# EAGLE schematic Transmitter Rev 1 (EAGLE 9.4.2)
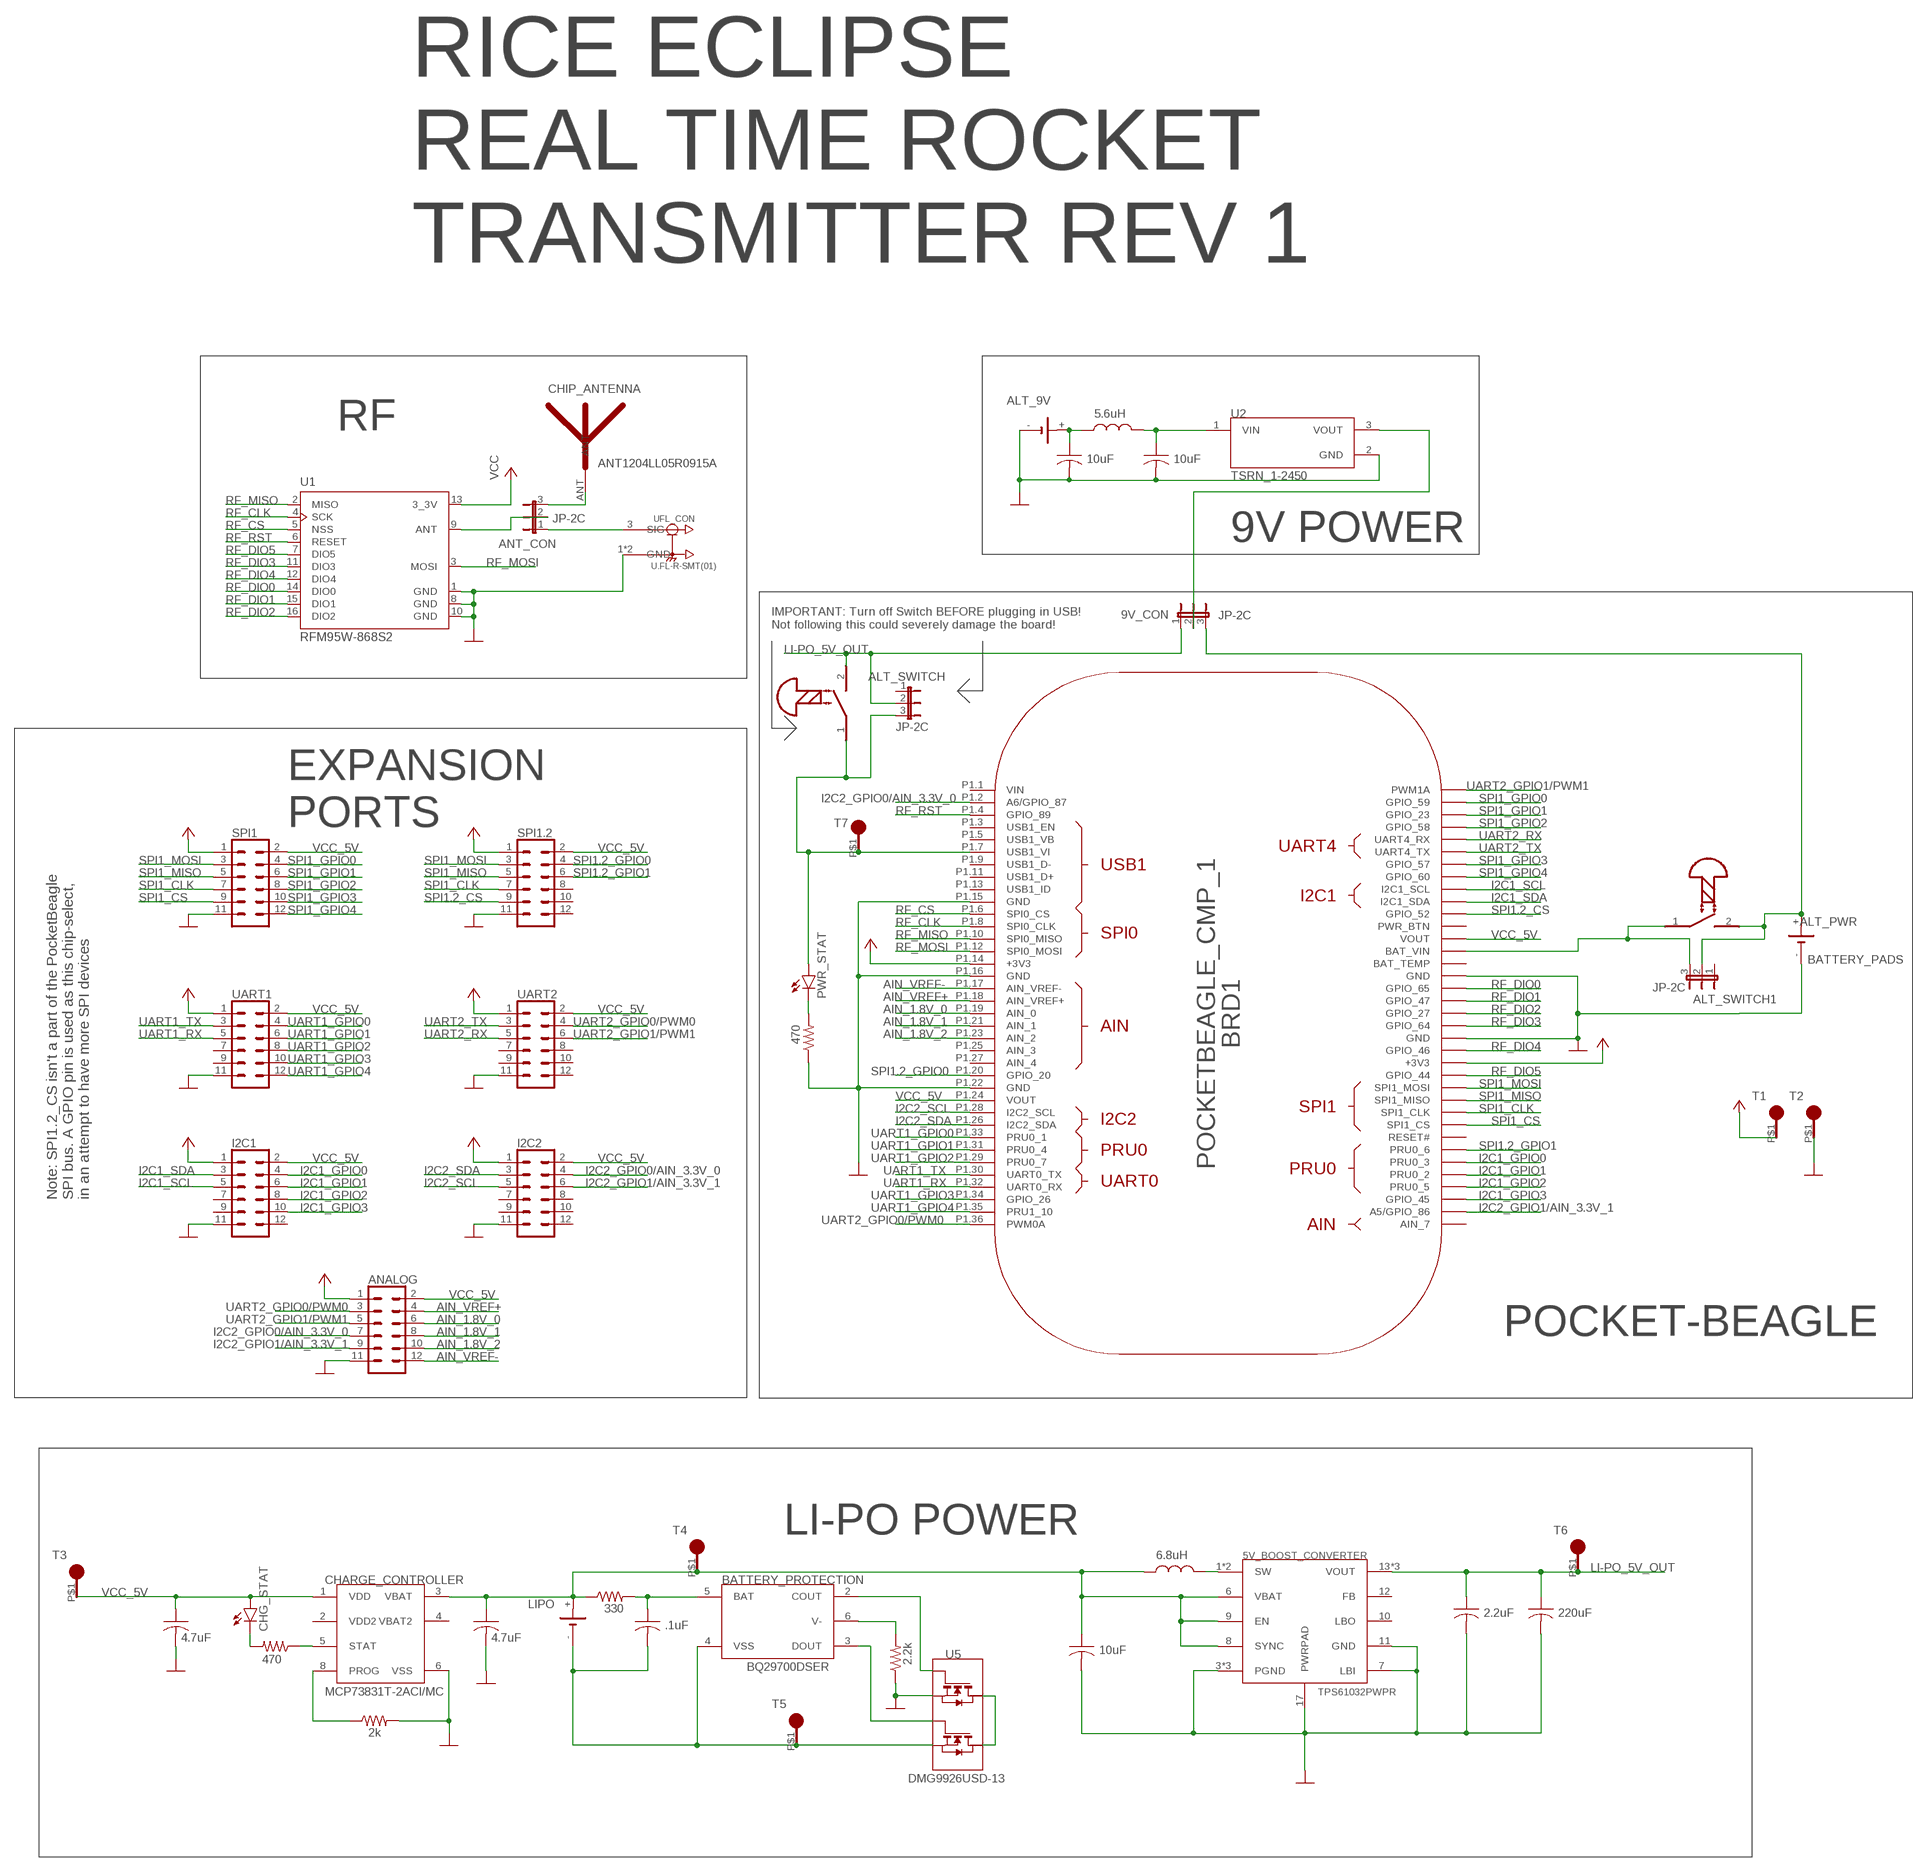
[diagram p0: schematic, sheet 1]

## Parts
5V_BOOST_CONVERTER  TPS61032PWPR  [SOP65P640X110-17N]
9V_C1  10uF  C-SMD  [C1206]
9V_C2  10uF  C-SMD  [C1206]
9V_CON  JP-2C  [JP2]
ALT_9V  BATTERY_PADS  [POWER_PADS]
ALT_PWR  BATTERY_PADS  [POWER_PADS]
ALT_SWITCH  JP-2C  [JP2]
ALT_SWITCH1  JP-2C  [JP2]
ANALOG  2X6 FEMALE  SENSOR_BREAKOUTPTH_FEMALE  [2X6]
ANT_CON  JP-2C  [JP2]
BATTERY_PROTECTION  BQ29700DSER  [SON50P150X150X80-6N]
BRD1  POCKETBEAGLE_CMP_1  [POCKETBEAGLE_CMP]
CHARGE_CONTROLLER  MCP73831T-2ACI/MC  [SON50P200X300X100-9N]
CHG_C1  4.7uF  C-SMD  [C1206]
CHG_C2  4.7uF  C-SMD  [C1206]
CHG_C3  .1uF  C-SMD  [C1206]
CHG_C4  10uF  C-SMD  [C1206]
CHG_C5  2.2uF  C-SMD  [C1206]
CHG_C6  220uF  C-SMD  [C1206]
CHG_R1  2k  R-SMD  [RES_SMW52R0JT]
CHG_R2  470  R-SMD  [RES_SMW52R0JT]
CHG_R3  330  R-SMD  [RES_SMW52R0JT]
CHG_R4  2.2k  R-SMD  [RES_SMW52R0JT]
CHG_R5  470  R-SMD  [RES_SMW52R0JT]
CHG_STAT  LED5MM  [LED5MM]
CHIP_ANTENNA  ANT1204LL05R0915A  [SMD_ANTENNA]
I2C1  2X6 FEMALE  SENSOR_BREAKOUTPTH_FEMALE  [2X6]
I2C2  2X6 FEMALE  SENSOR_BREAKOUTPTH_FEMALE  [2X6]
L1  5.6uH  L_SMD  [L-DS75LC]
L2  6.8uH  L_SMD  [L-DS75LC]
LIPO  BATTERY_PADS  [POWER_PADS]
PWR_STAT  LED5MM  [LED5MM]
SPI1  SNSR_BRKOUT  SENSOR_BREAKOUTPTH_FEMALE  [2X6]
SPI1.2  2X6 FEMALE  SENSOR_BREAKOUTPTH_FEMALE  [2X6]
SW1  SCREW_SWITCH  [SCREW_SWITCH]
SW2  SCREW_SWITCH  [SCREW_SWITCH]
T1  TEST_PAD  [TEST_PAD]
T2  TEST_PAD  [TEST_PAD]
T3  TEST_PAD  [TEST_PAD]
T4  TEST_PAD  [TEST_PAD]
T5  TEST_PAD  [TEST_PAD]
T6  TEST_PAD  [TEST_PAD]
T7  TEST_PAD  [TEST_PAD]
U1  RFM95W-868S2  [XCVR_RFM95W-868S2]
U2  TSRN_1-2450  [CONV_TSRN_1-2433]
U5  DMG9926USD-13  [SOIC127P600X175-8N]
UART1  2X6 FEMALE  SENSOR_BREAKOUTPTH_FEMALE  [2X6]
UART2  2X6 FEMALE  SENSOR_BREAKOUTPTH_FEMALE  [2X6]
UFL_CON  U.FL-R-SMT(01)  [HRS_U.FL-R-SMT(01)]

## Nets
AIN_1.8V_0: ANALOG.6 BRD1.P1.19(AIN_0)
AIN_1.8V_1: ANALOG.8 BRD1.P1.21(AIN_1)
AIN_1.8V_2: ANALOG.10 BRD1.P1.23(AIN_2)
AIN_VREF+: ANALOG.4 BRD1.P1.18(AIN_VREF+)
AIN_VREF-: ANALOG.12 BRD1.P1.17(AIN_VREF-)
GND: 5V_BOOST_CONVERTER.3(PGND) 5V_BOOST_CONVERTER.4(PGND) 5V_BOOST_CONVERTER.5(PGND) 5V_BOOST_CONVERTER.7(LBI) 5V_BOOST_CONVERTER.11(GND) 5V_BOOST_CONVERTER.17(PWRPAD) 9V_C1.2 9V_C2.2 ALT_9V.- ALT_PWR.- ANALOG.11 BRD1.P1.15(GND) BRD1.P1.16(GND) BRD1.P1.22(GND) BRD1.P2.15(GND) BRD1.P2.21(GND) CHARGE_CONTROLLER.6(VSS) CHG_C1.2 CHG_C2.2 CHG_C4.2 CHG_C5.2 CHG_C6.2 CHG_R1.2 CHG_R4.1 CHG_R5.1 I2C1.11 I2C2.11 SPI1.2.11 SPI1.11 T2.P$1 U1.1(GND) U1.8(GND) U1.10(GND) U2.2(GND) U5.1(S1) UART1.11 UART2.11 UFL_CON.1(GND) UFL_CON.2(GND)
I2C1_GPIO0: BRD1.P2.30(PRU0_3) I2C1.4
I2C1_GPIO1: BRD1.P2.32(PRU0_2) I2C1.6
I2C1_GPIO2: BRD1.P2.34(PRU0_5) I2C1.8
I2C1_GPIO3: BRD1.P2.33(GPIO_45) I2C1.10
I2C1_SCL: BRD1.P2.9(I2C1_SCL) I2C1.5
I2C1_SDA: BRD1.P2.11(I2C1_SDA) I2C1.3
I2C2_GPIO0/AIN_3.3V_0: ANALOG.7 BRD1.P1.2(A6/GPIO_87) I2C2.4
I2C2_GPIO1/AIN_3.3V_1: ANALOG.9 BRD1.P2.35(A5/GPIO_86) I2C2.6
I2C2_SCL: BRD1.P1.28(I2C2_SCL) I2C2.5
I2C2_SDA: BRD1.P1.26(I2C2_SDA) I2C2.3
LI-PO_5V_OUT: 5V_BOOST_CONVERTER.13(VOUT) 5V_BOOST_CONVERTER.14(VOUT) 5V_BOOST_CONVERTER.15(VOUT) 9V_CON.1 ALT_SWITCH.2 CHG_C5.1 CHG_C6.1 SW1.2 T6.P$1
N$1: ANT_CON.2 U1.9(ANT)
N$2: ANT_CON.3 CHIP_ANTENNA.ANT
N$3: ANT_CON.1 UFL_CON.3(SIG)
N$4: 9V_CON.3 ALT_PWR.+ ALT_SWITCH1.2 SW2.2
N$5: 9V_CON.2 U2.3(VOUT)
N$6: 9V_C2.1 L1.P$2 U2.1(VIN)
N$7: 9V_C1.1 ALT_9V.+ L1.P$1
N$8: CHG_R5.2 PWR_STAT.K(C)
N$9: CHARGE_CONTROLLER.5(STAT) CHG_R2.1
N$10: CHG_R2.2 CHG_STAT.K(C)
N$11: CHARGE_CONTROLLER.8(PROG) CHG_R1.1
N$12: BATTERY_PROTECTION.5(BAT) CHG_C3.1 CHG_R3.2
N$13: 5V_BOOST_CONVERTER.6(VBAT) 5V_BOOST_CONVERTER.8(SYNC) 5V_BOOST_CONVERTER.9(EN) CHARGE_CONTROLLER.3(VBAT) CHG_C2.1 CHG_C4.1 CHG_R3.1 L2.P$1 LIPO.+ T4.P$1
N$14: BATTERY_PROTECTION.4(VSS) CHG_C3.2 LIPO.- T5.P$1 U5.3(S2)
N$15: U5.5(D2) U5.6(D2) U5.7(D1) U5.8(D1)
N$16: BATTERY_PROTECTION.3(DOUT) U5.4(G2)
N$17: BATTERY_PROTECTION.6(V-) CHG_R4.2
N$18: BATTERY_PROTECTION.2(COUT) U5.2(G1)
N$19: ALT_SWITCH.3 BRD1.P1.7(USB1_VI) PWR_STAT.A SW1.1 T7.P$1
N$20: 5V_BOOST_CONVERTER.1(SW) 5V_BOOST_CONVERTER.2(SW) L2.P$2
N$22: ALT_SWITCH1.3 BRD1.P2.14(BAT_VIN) SW2.1
RF_CLK: BRD1.P1.8(SPI0_CLK) U1.4(SCK)
RF_CS: BRD1.P1.6(SPI0_CS) U1.5(NSS)
RF_DIO0: BRD1.P2.17(GPIO_65) U1.14(DIO0)
RF_DIO1: BRD1.P2.18(GPIO_47) U1.15(DIO1)
RF_DIO2: BRD1.P2.19(GPIO_27) U1.16(DIO2)
RF_DIO3: BRD1.P2.20(GPIO_64) U1.11(DIO3)
RF_DIO4: BRD1.P2.22(GPIO_46) U1.12(DIO4)
RF_DIO5: BRD1.P2.24(GPIO_44) U1.7(DIO5)
RF_MISO: BRD1.P1.10(SPI0_MISO) U1.2(MISO)
RF_MOSI: BRD1.P1.12(SPI0_MOSI) U1.3(MOSI)
RF_RST: BRD1.P1.4(GPIO_89) U1.6(RESET)
SPI1.2_CS: BRD1.P2.10(GPIO_52) SPI1.2.9
SPI1.2_GPIO0: BRD1.P1.20(GPIO_20) SPI1.2.4
SPI1.2_GPIO1: BRD1.P2.28(PRU0_6) SPI1.2.6
SPI1_CLK: BRD1.P2.29(SPI1_CLK) SPI1.2.7 SPI1.7
SPI1_CS: BRD1.P2.31(SPI1_CS) SPI1.9
SPI1_GPIO0: BRD1.P2.2(GPIO_59) SPI1.4
SPI1_GPIO1: BRD1.P2.3(GPIO_23) SPI1.6
SPI1_GPIO2: BRD1.P2.4(GPIO_58) SPI1.8
SPI1_GPIO3: BRD1.P2.6(GPIO_57) SPI1.10
SPI1_GPIO4: BRD1.P2.8(GPIO_60) SPI1.12
SPI1_MISO: BRD1.P2.27(SPI1_MISO) SPI1.2.5 SPI1.5
SPI1_MOSI: BRD1.P2.25(SPI1_MOSI) SPI1.2.3 SPI1.3
UART1_GPIO0: BRD1.P1.33(PRU0_1) UART1.4
UART1_GPIO1: BRD1.P1.31(PRU0_4) UART1.6
UART1_GPIO2: BRD1.P1.29(PRU0_7) UART1.8
UART1_GPIO3: BRD1.P1.34(GPIO_26) UART1.10
UART1_GPIO4: BRD1.P1.35(PRU1_10) UART1.12
UART1_RX: BRD1.P1.32(UART0_RX) UART1.5
UART1_TX: BRD1.P1.30(UART0_TX) UART1.3
UART2_GPIO0/PWM0: ANALOG.3 BRD1.P1.36(PWM0A) UART2.4
UART2_GPIO1/PWM1: ANALOG.5 BRD1.P2.1(PWM1A) UART2.6
UART2_RX: BRD1.P2.5(UART4_RX) UART2.5
UART2_TX: BRD1.P2.7(UART4_TX) UART2.3
VCC: ANALOG.1 BRD1.P1.14(+3V3) BRD1.P2.23(+3V3) I2C1.1 I2C2.1 SPI1.1 SPI1.2.1 T1.P$1 U1.13(3_3V) UART1.1 UART2.1
VCC_5V: ANALOG.2 BRD1.P1.24(VOUT) BRD1.P2.13(VOUT) CHARGE_CONTROLLER.1(VDD) CHG_C1.1 CHG_STAT.A I2C1.2 I2C2.2 SPI1.2 SPI1.2.2 T3.P$1 UART1.2 UART2.2
Unconnected: 5V_BOOST_CONVERTER.10(LBO) 5V_BOOST_CONVERTER.12(FB) ALT_SWITCH1.1 ALT_SWITCH.1 BRD1.P1.1(VIN) BRD1.P1.3(USB1_EN) BRD1.P1.5(USB1_VB) BRD1.P1.9(USB1_D-) BRD1.P1.11(USB1_D+) BRD1.P1.13(USB1_ID) BRD1.P1.25(AIN_3) BRD1.P1.27(AIN_4) BRD1.P2.12(PWR_BTN) BRD1.P2.16(BAT_TEMP) BRD1.P2.26(RESET#) BRD1.P2.36(AIN_7) CHARGE_CONTROLLER.2(VDD2) CHARGE_CONTROLLER.4(VBAT2) I2C1.7 I2C1.9 I2C1.12 I2C2.7 I2C2.8 I2C2.9 I2C2.10 I2C2.12 SPI1.2.8 SPI1.2.10 SPI1.2.12 UART1.7 UART1.9 UART2.7 UART2.8 UART2.9 UART2.10 UART2.12

## Notes on the sheet
- RICE ECLIPSE
  REAL TIME ROCKET
  TRANSMITTER REV 1
- RF
- 9V POWER
- IMPORTANT: Turn off Switch BEFORE plugging in USB! 
  Not following this could severely damage the board!
- EXPANSION
  PORTS
- Note: SPI1.2_CS isn't a part of the PocketBeagle 
  SPI bus. A GPIO pin is used as this chip-select, 
  in an attempt to have more SPI devices
- POCKET-BEAGLE
- LI-PO POWER

## Library data of the parts
5V_BOOST_CONVERTER = RTR:TPS61032PWPR: 5V Buck-Boost Converter; 5V_BOOST_CONVERTER: TPS61032PWPR; F: TPS61032PWPR
9V_C1 9V_C2 CHG_C1-CHG_C6 = RTR:C-SMD: SMD capacitor
9V_CON ALT_SWITCH ALT_SWITCH1 ANT_CON = RTR:JP-2C: JUMPER 2 connection jumper
ALT_9V ALT_PWR LIPO = RTR:BATTERY_PADS: Pads to connect any battery (Li-Po, 9V, etc.)
ANALOG I2C1 I2C2 SPI1.2 UART1 UART2 = RTR:SENSOR_BREAKOUT: .1 inch-spaced 12P sensor breakout Used as a generalized connector for attaching new sensors; PROD_ID: CONN-12423
BATTERY_PROTECTION = RTR:BQ29700DSER: Battery Protection IC
BRD1 = RTR:POCKETBEAGLE_?_1: BeagleBoard.org PocketBeagle What is PocketBeagle? PocketBeagle is an ultra-tiny-yet-complete open-source USB-key-fob computer. PocketBeagle features an incredible low cost, slick design and simple usage, making PocketBeagle the ideal development board for beginners and professionals alike. Processor: Octavo Systems OSD3358 1GHz ARMÂ® Cortex-A8 512MB DDR3 RAM integrated Integrated power management 2Ã—32-bit 200-MHz programmable real-time units (PRUs) ARM Cortex-M3 Summary of Key Features Low cost Linux computer with tremendous expansibility Opportunity to learn many programming aspects from educators on-line Openness and flexibility tear-down limits on your imagination Summary of Technical Specifications Based on new Octavo Systems OSD3358-SM 21mm x 21mm system-in-package that includes 512MB DDR3 RAM, 1-GHz ARM Cortex-A8 CPU, 2x 200-MHz PRUs, ARM Cortex-M3, 3D accelerator, power/battery management and EEPROM 72 expansion pin headers with power and battery I/Os, high-speed USB, 8 analog inputs, 44 digital I/Os and numerous digital interface peripherals microUSB host/client and microSD connectors
CHARGE_CONTROLLER = RTR:MCP73831T-2ACI/MC: MCP73831T-2ACI/MC Charge Controller
CHG_R1-CHG_R5 = RTR:R-SMD: SMD resistor
CHG_STAT PWR_STAT = RTR:LED: LED OSRAM: - CHIPLED LG R971, LG N971, LY N971, LG Q971, LY Q971, LO R971, LY R971 LH N974, LH R974 LS Q976, LO Q976, LY Q976 LO Q996 - Hyper CHIPLED LW Q18S LB Q993, LB Q99A, LB R99A - SideLED LS A670, LO A670, LY A670, LG A670, LP A670 LB A673, LV A673, LT A673, LW A673 LH A674 LY A675 LS A676, LA A676, LO A676, LY A676, LW A676 LS A679, LY A679, LG A679 - Hyper Micro SIDELED® LS Y876, LA Y876, LO Y876, LY Y876 LT Y87S - SmartLED LW L88C, LW L88S LB L89C, LB L89S, LG L890 LS L89K, LO L89K, LY L89K LS L896, LA L896, LO L896, LY L896 - TOPLED LS T670, LO T670, LY T670, LG T670, LP T670 LSG T670, LSP T670, LSY T670, LOP T670, LYG T670 LG T671, LOG T671, LSG T671 LB T673, LV T673, LT T673, LW T673 LH T674 LS T676, LA T676, LO T676, LY T676, LB T676, LH T676, LSB T676, LW T676 LB T67C, LV T67C, LT T67C, LS T67K, LO T67K, LY T67K, LW E67C LS E67B, LA E67B, LO E67B, LY E67B, LB E67C, LV E67C, LT E67C LW T67C LS T679, LY T679, LG T679 LS T770, LO T770, LY T770, LG T770, LP T770 LB T773, LV T773, LT T773, LW T773 LH T774 LS E675, LA E675, LY E675, LS T675 LS T776, LA T776, LO T776, LY T776, LB T776 LHGB T686 LT T68C, LB T68C - Hyper Mini TOPLED® LB M676 - Mini TOPLED Santana® LG M470 LS M47K, LO M47K, LY M47K Source: http://www.osram.convergy.de LUXEON: - LUMILED® LXK2-PW12-R00, LXK2-PW12-S00, LXK2-PW14-U00, LXK2-PW14-V00 LXK2-PM12-R00, LXK2-PM12-S00, LXK2-PM14-U00 LXK2-PE12-Q00, LXK2-PE12-R00, LXK2-PE12-S00, LXK2-PE14-T00, LXK2-PE14-U00 LXK2-PB12-K00, LXK2-PB12-L00, LXK2-PB12-M00, LXK2-PB14-N00, LXK2-PB14-P00, LXK2-PB14-Q00 LXK2-PR12-L00, LXK2-PR12-M00, LXK2-PR14-Q00, LXK2-PR14-R00 LXK2-PD12-Q00, LXK2-PD12-R00, LXK2-PD12-S00 LXK2-PH12-R00, LXK2-PH12-S00 LXK2-PL12-P00, LXK2-PL12-Q00, LXK2-PL12-R00 Source: www.luxeon.com KINGBRIGHT: KA-3528ASYC Source: www.kingbright.com
CHIP_ANTENNA = RTR:ANT1204LL05R0915A: On board chip antenna
L1 L2 = RTR:L_SMD: SMD Inductor
SPI1 = RTR:SENSOR_BREAKOUT: .1 inch-spaced 12P sensor breakout Used as a generalized connector for attaching new sensors; PROD_ID: CONN-12423; VALUE: 2X6 FEMALE
SW1 SW2 = RTR:SCREW_SWITCH: Custom screw switch for integrated PCB design
T1-T7 = RTR:TEST_PAD: Test pad
U1 = RTR:RFM95W-868S2: RFM95 Transceiver; AVAILABILITY: Unavailable; MF: RF; MP: RFM95W-868S2; PACKAGE: SMD-16 Hope Microelectronics; PRICE: None
U2 = RTR:TSRN_1-2450: 1.6 A Watt, 6.5-42VDCVin, Quad Output, 5V@1A | -5V@0.6A Switching Regulators DC-DC Converter; AVAILABILITY: Unavailable; DESCRIPTION: 1.6 A Watt, 6.5-42VDCVin, Quad Output, 5V@1A | -5V@0.6A Switching Regulators DC-DC Converter; MF: Traco Power; MP: TSRN 1-2450; PACKAGE: SIP-3 Tracopower; PRICE: None
U5 = RTR:DMG9926USD-13: Dual N-Channel MOSFET
UFL_CON = RTR:U.FL-R-SMT(01): U.FL Series 6 Ghz 50 Ohm Ultra-small SMT Coaxial Cable Receptacle; DESCRIPTION: U.FL Series 6 Ghz 50 Ohm Ultra-small SMT Coaxial Cable Receptacle; DIGI-KEY_PART_NUMBER: H9161-ND; DIGI-KEY_PURCHASE_URL: https://www.digikey.com/product-detail/en/hirose-electric-co-ltd/U.FL-R-SMT_01_/H9161-ND/513010?utm_source=snapeda&utm_medium=aggregator&utm_campaign=symbol; MF: Hirose; MP: U.FL-R-SMT_01_; PACKAGE: None